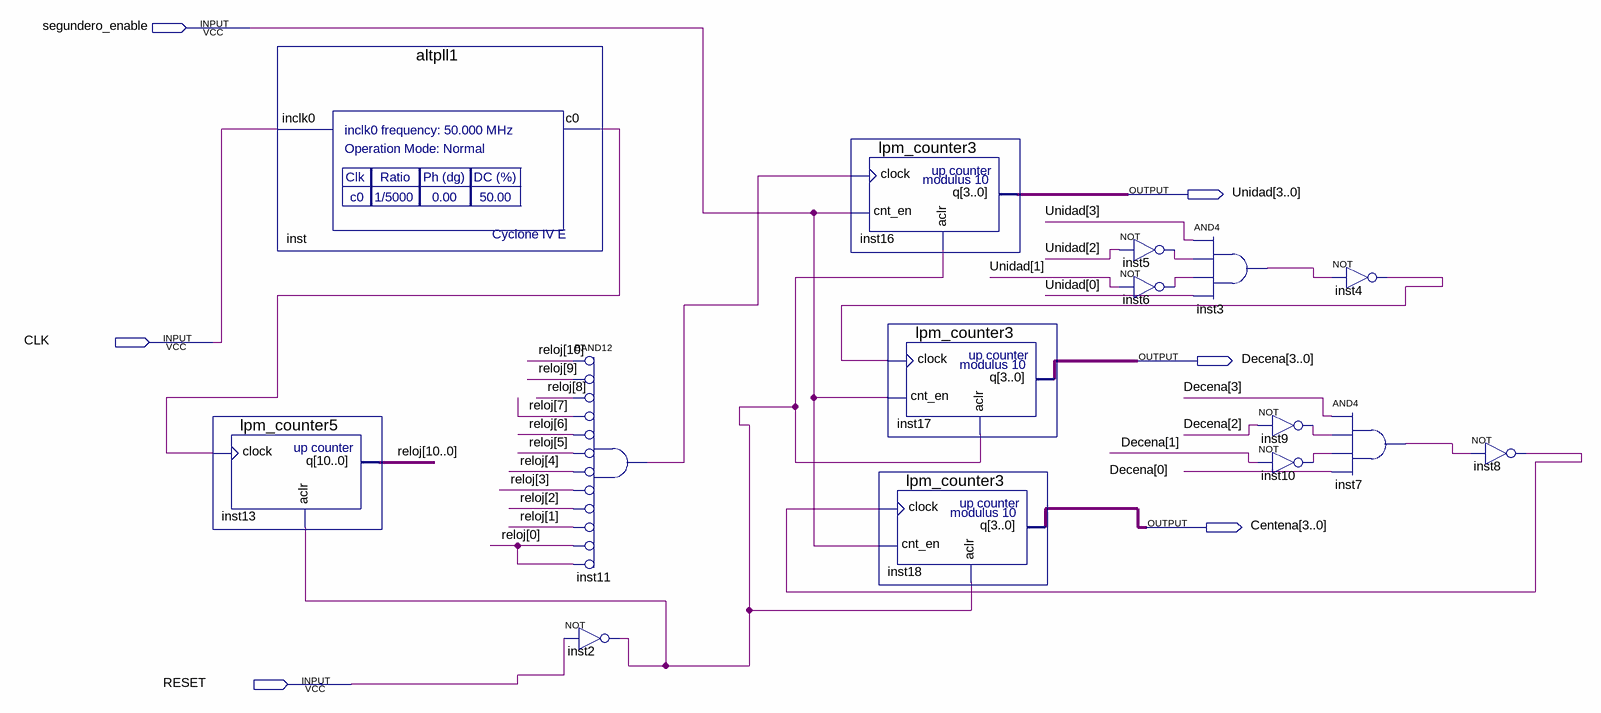
[diagram p0: schematic sheet]
// Quartus schematic segundero.bdf as structural Verilog: 15 symbols, 6 pins
module segundero (
  input  segundero_enable,
  input  CLK,
  input  RESET,
  output [3:0] Unidad,
  output [3:0] Decena,
  output [3:0] Centena
);

  wire inst2_out, inst3_out, inst4_out, inst5_out, inst6_out, inst7_out, inst8_out, inst9_out, inst10_out,
       inst11_out, inst_c0;
  wire [10:0] reloj;

  lpm_counter5 inst13 (.clock(inst_c0), .aclr(inst2_out), .q(reloj));
  altpll1 inst (.inclk0(CLK), .c0(inst_c0));
  not inst2 (inst2_out, RESET);
  and inst11 (inst11_out, ~reloj[10], ~reloj[9], ~reloj[8], ~reloj[7], ~reloj[6], ~reloj[5], ~reloj[4], ~reloj[3], ~reloj[2], ~reloj[1], ~reloj[0], ~reloj[0]);  // BAND12
  lpm_counter3 inst16 (.clock(inst11_out), .cnt_en(segundero_enable), .aclr(inst2_out), .q(Unidad));
  lpm_counter3 inst17 (.clock(inst4_out), .cnt_en(segundero_enable), .aclr(inst2_out), .q(Decena));
  lpm_counter3 inst18 (.clock(inst8_out), .cnt_en(segundero_enable), .aclr(inst2_out), .q(Centena));
  not inst5 (inst5_out, Unidad[2]);
  not inst6 (inst6_out, Unidad[1]);
  and inst3 (inst3_out, Unidad[3], inst5_out, inst6_out, Unidad[0]);
  not inst9 (inst9_out, Decena[2]);
  not inst10 (inst10_out, Decena[1]);
  not inst4 (inst4_out, inst3_out);
  and inst7 (inst7_out, Decena[3], inst9_out, inst10_out, Decena[0]);
  not inst8 (inst8_out, inst7_out);
endmodule
